# Altium schematic sheet Controller Headers.SchDoc: Modular Parent Motherboard
size Letter; DrawnBy: MTAN; Organization: Altium Limited; DocumentNumber: 5; Revision: B; SheetNumber: 5; SheetTotal: 6
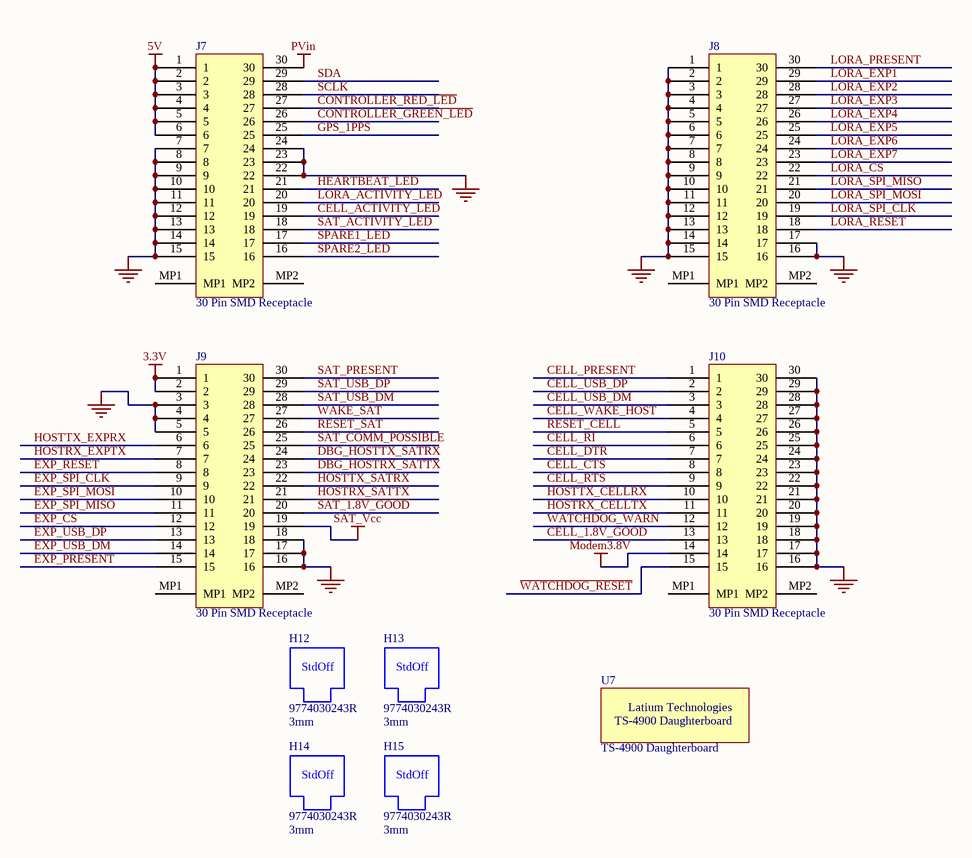
[diagram p0: Controller Headers.SchDoc]

## Parts
H12  9774030243R  Height: 3mm  [Wurth 9774030243R]
H13  9774030243R  Height: 3mm  [Wurth 9774030243R]
H14  9774030243R  Height: 3mm  [Wurth 9774030243R]
H15  9774030243R  Height: 3mm  [Wurth 9774030243R]
J7  30 Pin SMD Receptacle  [10132798-031100LF]
J8  30 Pin SMD Receptacle  [10132798-031100LF]
J9  30 Pin SMD Receptacle  [10132798-031100LF]
J10  30 Pin SMD Receptacle  [10132798-031100LF]
U7  TS-4900 Daughterboard  [TS-4900 Daughterboard]  (no BOM)

## Nets
3.3V: J9.1 J9.2
5V: J7.1 J7.2 J7.3 J7.4 J7.5 J7.6
GND: J7.7 J7.8 J7.9 J7.10 J7.11 J7.12 J7.13 J7.14 J7.15 J7.22 J7.23 J7.24 J8.1 J8.2 J8.3 J8.4 J8.5 J8.6 J8.7 J8.8 J8.9 J8.10 J8.11 J8.12 J8.13 J8.14 J8.15 J8.16 J8.17 J9.3 J9.4 J9.5 J9.16 J9.17 J9.18 J10.16 J10.17 J10.18 J10.19 J10.20 J10.21 J10.22 J10.23 J10.24 J10.25 J10.26 J10.27 J10.28 J10.29 J10.30
Modem3.8V: J10.14
PVin: J7.30
SAT_Vcc: J9.19
~{CELL_1.8V_GOOD}: J10.13
~{CELL_WAKE_HOST}: J10.4
~{CONTROLLER_GREEN_LED}: J7.26
~{CONTROLLER_RED_LED}: J7.27
CELL_ACTIVITY_LED: J7.19
CELL_CTS: J10.8
CELL_DTR: J10.7
CELL_PRESENT: J10.1
CELL_RI: J10.6
CELL_RTS: J10.9
CELL_USB_DM: J10.3
CELL_USB_DP: J10.2
DBG_HOSTRX_SATTX: J9.23
DBG_HOSTTX_SATRX: J9.24
~{EXP_CS}: J9.12
EXP_PRESENT: J9.15
EXP_RESET: J9.8
EXP_SPI_CLK: J9.9
EXP_SPI_MISO: J9.11
EXP_SPI_MOSI: J9.10
EXP_USB_DM: J9.14
EXP_USB_DP: J9.13
GPS_1PPS: J7.25
HEARTBEAT_LED: J7.21
HOSTRX_CELLTX: J10.11
HOSTRX_EXPTX: J9.7
HOSTRX_SATTX: J9.21
HOSTTX_CELLRX: J10.10
HOSTTX_EXPRX: J9.6
HOSTTX_SATRX: J9.22
~{LORA_CS}: J8.22
LORA_ACTIVITY_LED: J7.20
LORA_EXP1: J8.29
LORA_EXP2: J8.28
LORA_EXP3: J8.27
LORA_EXP4: J8.26
LORA_EXP5: J8.25
LORA_EXP6: J8.24
LORA_EXP7: J8.23
LORA_PRESENT: J8.30
LORA_RESET: J8.18
LORA_SPI_CLK: J8.19
LORA_SPI_MISO: J8.21
LORA_SPI_MOSI: J8.20
RESET_CELL: J10.5
RESET_SAT: J9.26
~{SAT_1.8V_GOOD}: J9.20
SAT_ACTIVITY_LED: J7.18
SAT_COMM_POSSIBLE: J9.25
SAT_PRESENT: J9.30
SAT_USB_DM: J9.28
SAT_USB_DP: J9.29
SCLK: J7.28
SDA: J7.29
SPARE1_LED: J7.17
SPARE2_LED: J7.16
~{WATCHDOG_RESET}: J10.15
WAKE_SAT: J9.27
WATCHDOG_WARN: J10.12

Not connected (* = marked no-connect by the designer): J7 MP1 MP2; J8 MP1 MP2; J9 MP1 MP2; J10 MP1 MP2

## Notes on the sheet
- Title
- Drawn By:
- Date:
- Time:
- Revision:
- Sheet
- of
- The Latium Group of Companies
- 1312 10 Street
- Nisku, Alberta
- T9E 8K2
- Canada
- File:
- (in symbol SMD M3 Spacer) StdOff
- (in symbol TS-4900 Daughterboard) Latium Technologies

## Library data of the parts
H12-H15 = SMD M3 Spacer: ROUND STANDOFF M2X0.4 STEEL 3MM; Manufacturer: Wurth Electronics Inc; Supplier 1: Digi-Key; Value: 9774030243R; Manufacturer Part Number: 9774030243R; ComponentLink1Description: Drawing; ComponentLink1URL: S:\Hardware\Data Sheets\Passive\Standoffs\Wurth 9774070360R.pdf; Supplier 1 Part Number: 732-7085-1-ND
J7-J10 = Amphenol 30 Pos BergStak Plug: CONN RCPT 30POS SMD GOLD; Manufacturer: Amphenol ICC (FCI); Note: Mates with 10132797-031100LF plug 3mm between board height; Value: 30 Pin SMD Receptacle; Manufacturer Part Number: 10132798-031100LF; Supplier 1: Digi-Key; Supplier 1 Part Number: 609-5030-1-ND
U7 = TS-4900 Daughterboard: Value: TS-4900 Daughterboard